# EAGLE design HIVDC (EAGLE 9.6.2)
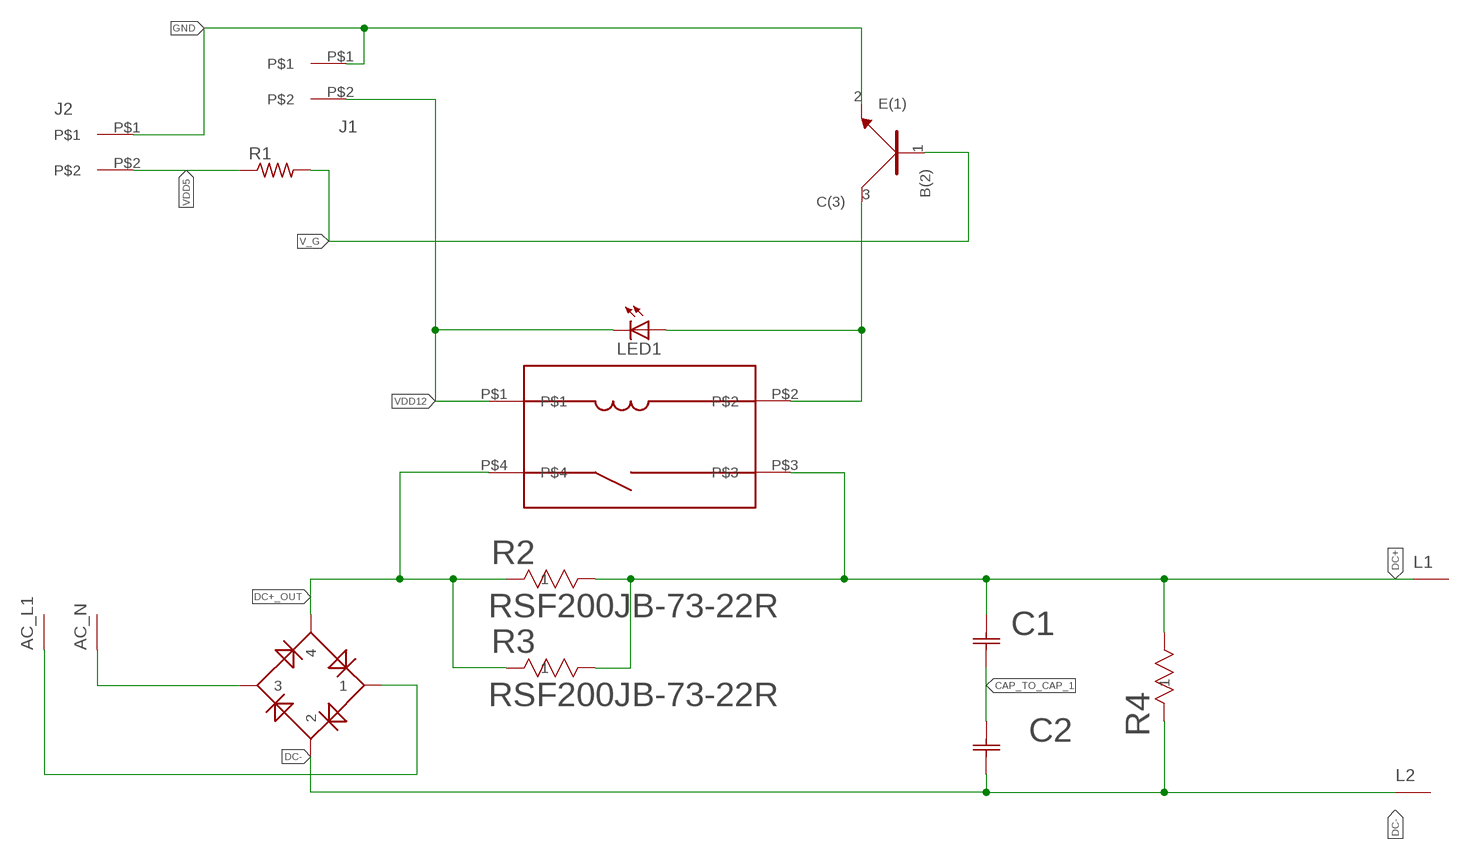
[diagram p0: schematic, sheet 1]

## Parts
AC_L1  AC_240V_L_15A  [AC_240V_L1_15A]
AC_N  AC_240V_N_15A  [AC_240V_L1_15A]
C1  SLP152M250H9P3  [CAP_SLP152M250H9P3_CND]
C2  SLP152M250H9P3  [CAP_SLP152M250H9P3_CND]
J1  2-pos  3.81MM_1_X_2_RT_ANGLE_PLUG_HEADER  [2_3.81MM_PITCH]
J2  2-pos  3.81MM_1_X_2_RT_ANGLE_PLUG_HEADER  [2_3.81MM_PITCH]
L1  DC_HI_V  [AC_240V_L1_15A]
L2  DC_HI_V  [AC_240V_L1_15A]
LED1  Green  LED_0805_GREEN  [0805]
R1  R_0402  [0402]
R2  RSF200JB-73-22R  [YAG_RSF200_YAG]
R3  RSF200JB-73-22R  [YAG_RSF200_YAG]
R4  RS00547K00FE73  [RS005_VIS]
RL1  J120D1AS12VDCP  [J120D]
U1  NPN  BC846BW  [SOT323]
U$1  KBPC5010W-G  [KBPC-W_THRU]

## Nets
AC_L1: AC_L1.P$1 U$1.1
AC_N: AC_N.P$1 U$1.3
CAP_TO_CAP_1: C1.2 C2.1
DC+: C1.1 L1.P$1 R2.2 R3.2 R4.2 RL1.P$3
DC+_OUT: R2.1 R3.1 RL1.P$4 U$1.4
DC-: C2.2 L2.P$1 R4.1 U$1.2
GND: J1.P$1 J2.P$1 U1.2(E(1))
N$2: LED1.1(A) RL1.P$2 U1.3(C(3))
V_G: R1.P$2 U1.1(B(2))
VDD5: J2.P$2 R1.P$1
VDD12: J1.P$2 LED1.2(C) RL1.P$1

## Library data of the parts
AC_L1 = 3D_MIG_Controller:AC_240V_L_15A
AC_N = 3D_MIG_Controller:AC_240V_N_15A
C1 C2 = 3D_MIG_Controller:SLP152M250H9P3; BUILT_BY: EMA_Kyle; COPYRIGHT: Copyright (C) 2018 Accelerated Designs. All rights reserved; DATASHEET: https://www.cde.com/resources/catalogs/SLP.pdf; MANUFACTURER_PART_NUMBER: SLP152M250H9P3; SOURCELIBRARY: Add_to_database_2021-04-21; VENDOR: Cornell Dubilier
J1 J2 = 3D_MIG_Controller:3.81MM_1_X_2_RT_ANGLE_PLUG_HEADER: TERM BLOCK HDR 2POS 90DEG 3.81MM; PARTNO: 691322310002
L1 L2 = 3D_MIG_Controller:DC_HI_V
LED1 = 3D_MIG_Controller:LED_0805_GREEN: Green 570nm LED Indication - Discrete 2.2V 0805 (2012 Metric); PARTNO: LG R971-KN-1
R1 = 3D_MIG_Controller:R_0402
R2 R3 = 3D_MIG_Controller:RSF200JB-73-22R; BUILT_BY: EMA_UL_Team; MANUFACTURER_PART_NUMBER: RSF200JB-73-22R; SOURCELIBRARY: Yageo_2014-12-31; VENDOR: Yageo
R4 = 3D_MIG_Controller:RS00547K00FE73; BUILT_BY: EMA_UL_Team; MANUFACTURER_PART_NUMBER: RS00547K00FE73; SOURCELIBRARY: Vishay_2014-12-31; VENDOR: Vishay
RL1 = 3D_MIG_Controller:J120D1AS12VDCP
U1 = 3D_MIG_Controller:BC846BW: Bipolar (BJT) Transistor NPN 100MHz Surface Mount SOT-323; PARTNO: BC846BW_NPN
U$1 = 3D_MIG_Controller:KBPC5010W-G

## Board
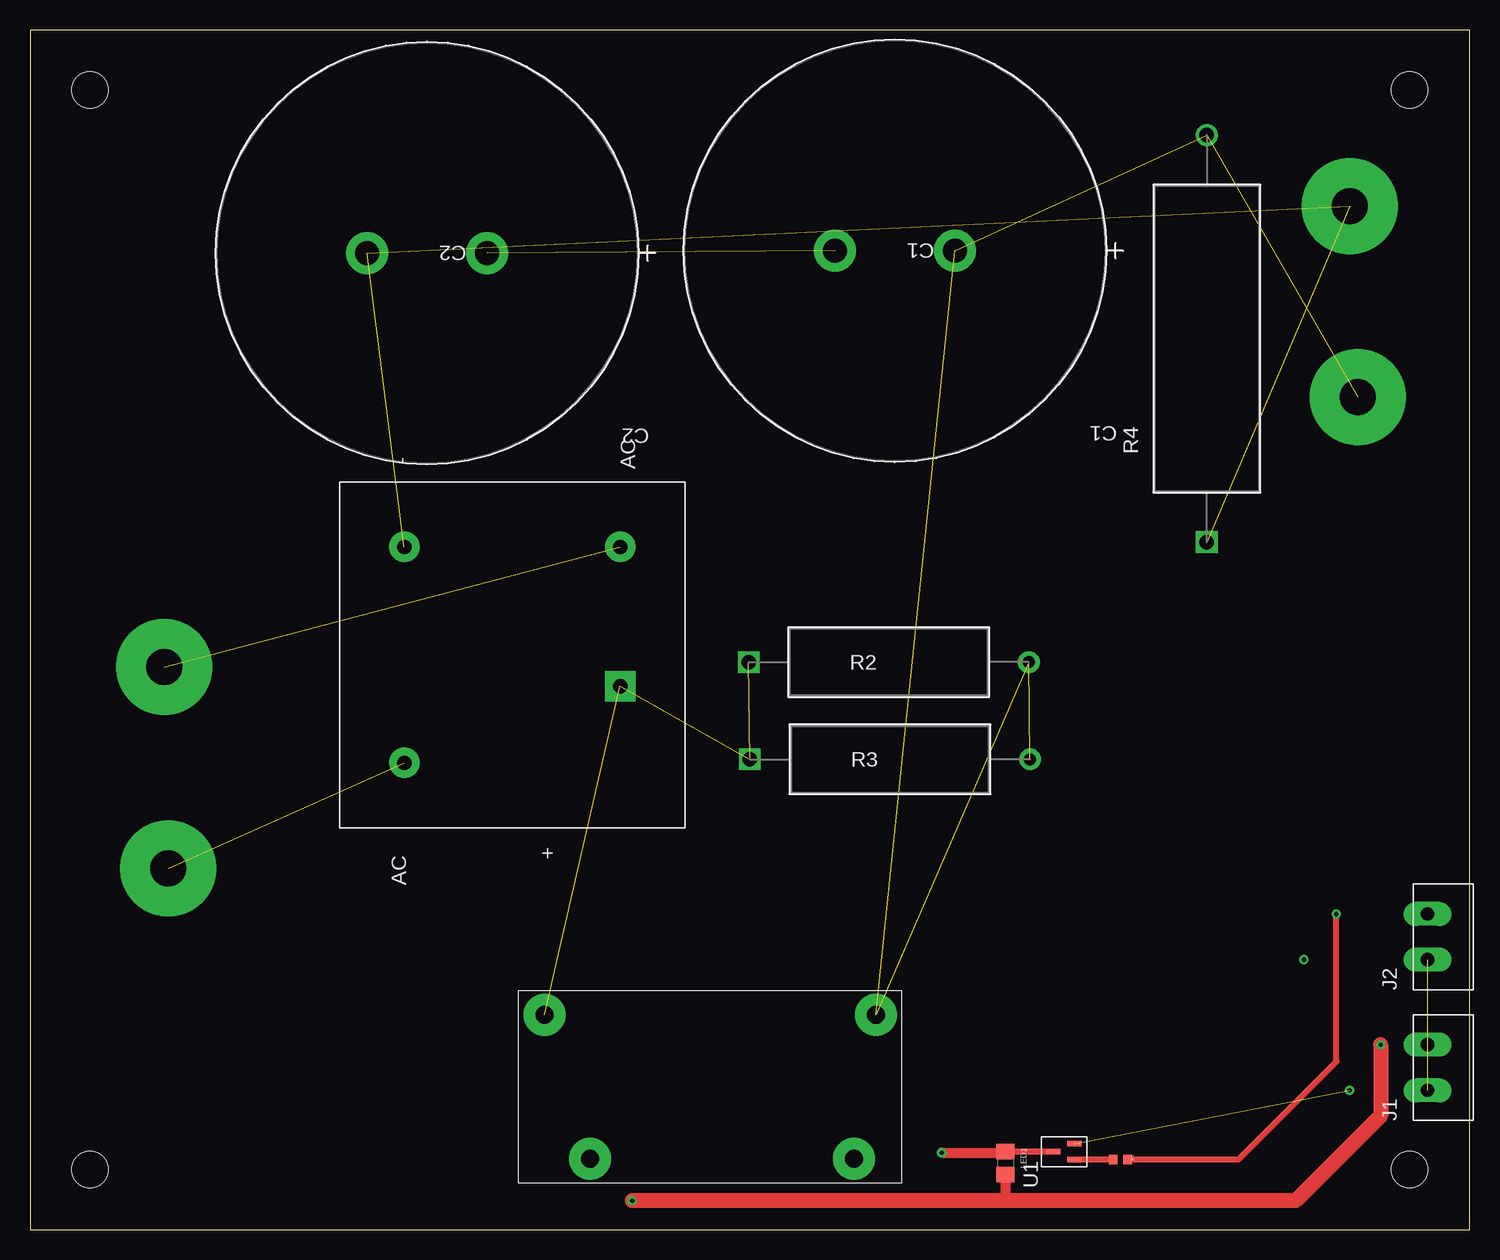
[diagram p1: board, top side]
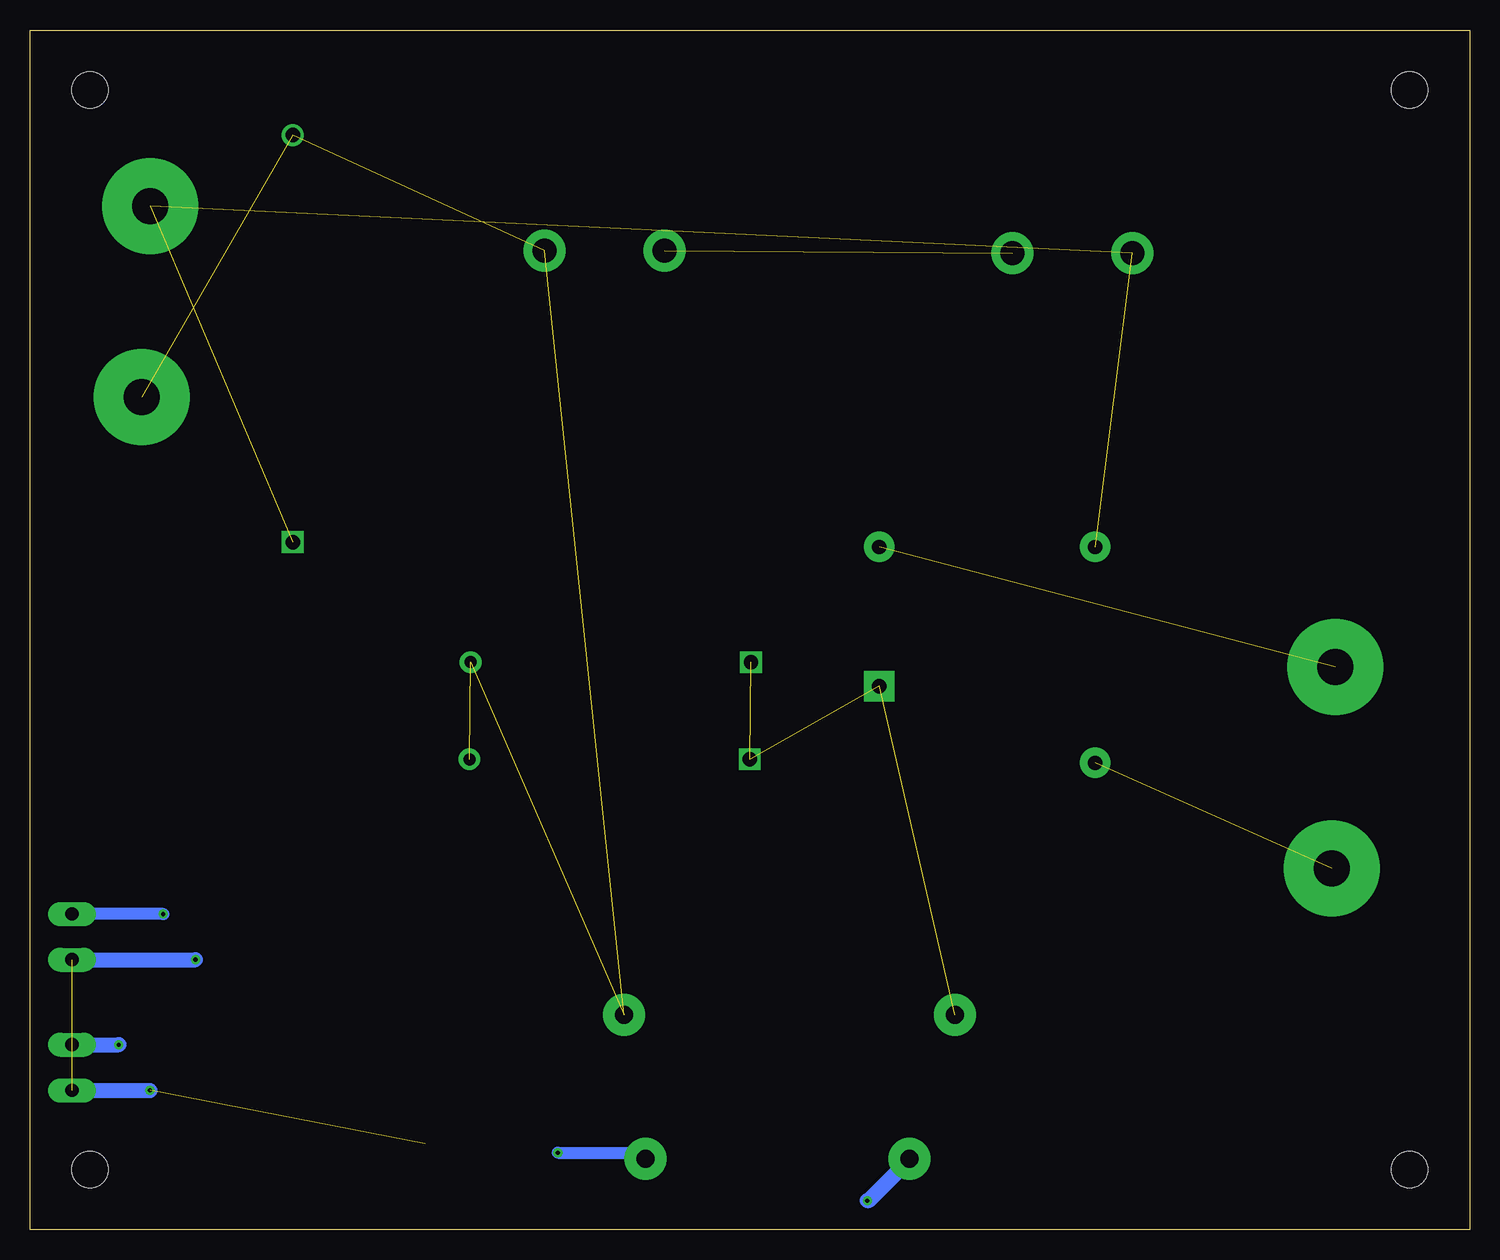
[diagram p2: board, bottom side, seen from below]

Size 120 x 100 mm. Coordinates in mm from the lower left corner, seen from the top.
Outline: 0,0 120,0 120,100 0,100 0,0
Copper layers (1*16): Top 0.035mm / dielectric 1.5mm / Bottom 0.035mm
Design rules "default": minimum track width 6mil, minimum drill 0.35mm, track to track 6mil, track to pad 6mil, pad to pad 6mil, via to via 6mil, smd to smd 6mil, copper to edge 40mil, drill to drill 6mil, minimum pad ring 10mil, minimum via ring 8mil, stop-mask expansion 4mil, vias tented up to drill 0mil, thermal gap 10mil
Holes 3 mm at 5,5 115,5 115,95 5,95

### Footprints (pad centres in the part's own frame; a part is rotated, then mirrored left to right if it is on the bottom)
AC_240V_L1_15A = drill 3 pad 8: P$1 0,0
CAP_SLP152M250H9P3_CND = drill 1.999 pad 3.5: 1 0,0; 2 10.008,0
2_3.81MM_PITCH = drill 1.1 pad 2 long: P$1 0,0; P$2 3.81,0
0805 = smd 1.3 x 1.5: 1 -0.95,0; 2 0.95,0
0402 = smd 0.8 x 0.7: P$1 0,0.6; P$2 0,-0.6
YAG_RSF200_YAG = drill 1.2 pad 1.8 square: 1 0,0 | drill 1 pad 1.8: 2 23.368,0
RS005_VIS = drill 1.2 pad 1.829 square: 1 0,0 | drill 1.2 pad 1.829: 2 33.934,0
J120D = drill 1.5 pad 3.5: P$1 -10,-6; P$2 12,-6; P$3 13.8,6; P$4 -13.8,6
SOT323 = smd 0.457 x 1.168: 1 -0.65,-0.876; 2 0.65,-0.876; 3 0,0.876
KBPC-W_THRU = drill 1.2 pad 2.54: 1 -9,9; 2 -9,-9; 3 9,-9 | drill 1.2 pad 2.54 square: 4 2.6,9

### Placement (x,y rotation side)
AC_L1  11.2,46.9 0 top
AC_N  11.5,30.1 0 top
C1  77.1,81.6 180 top
C2  38.1,81.4 180 top
J1  116.5,11.6 90 top
J2  116.5,22.5 90 top
L1  110.7,69.4 0 top
L2  110,85.3 0 top
LED1  81.3,5.55 270 top
R1  90.9,5.85 270 top
R2  59.9,47.3 0 top
R3  60,39.2 0 top
R4  98.1,57.3 90 top
RL1  56.7,11.9 0 top
U1  86.2,6.5 90 top
U$1  40.2,47.9 270 top

### Tracks (layer width: path | path; a pad name or v marks a point on that pad's centre or on a via)
AC_L1  (1 unrouted)
AC_N  (1 unrouted)
CAP_TO_CAP_1  (1 unrouted)
DC+  (5 unrouted)
DC+_OUT  (3 unrouted)
DC-  (3 unrouted)
GND  (via drill 0.35)  (2 unrouted)
  Bottom 1.27: J1.P$1 v110,11.6 | J2.P$1 v106.2,22.5
N$2  (via drill 0.35)
  Top 0.508: U1.3 LED1.1
  Top 0.813: v76,6.4 81.2,6.4 LED1.1
  Bottom 1.016: v76,6.4 69.2,6.4 RL1.P$2
V_G
  Top 0.508: U1.1 R1.P$2
VDD5  (via drill 0.35)
  Top 0.508: R1.P$1 100.75,5.85 108.9,14 v108.9,26.3
  Bottom 1.016: v108.9,26.3 v108.89,26.31 J2.P$2
VDD12  (via drill 0.35)
  Top 0.813: LED1.2 81.3,2.4
  Top 1.27: v50.2,2.4 81.3,2.4 105.5,2.4 112.6,9.5 v112.6,15.4
  Bottom 1.27: v50.2,2.4 50.1,2.4 46.7,5.8 RL1.P$1 | J1.P$2 v112.61,15.41 v112.6,15.4